# Altium schematic sheet AD8367_AGC.SchDoc
size A4
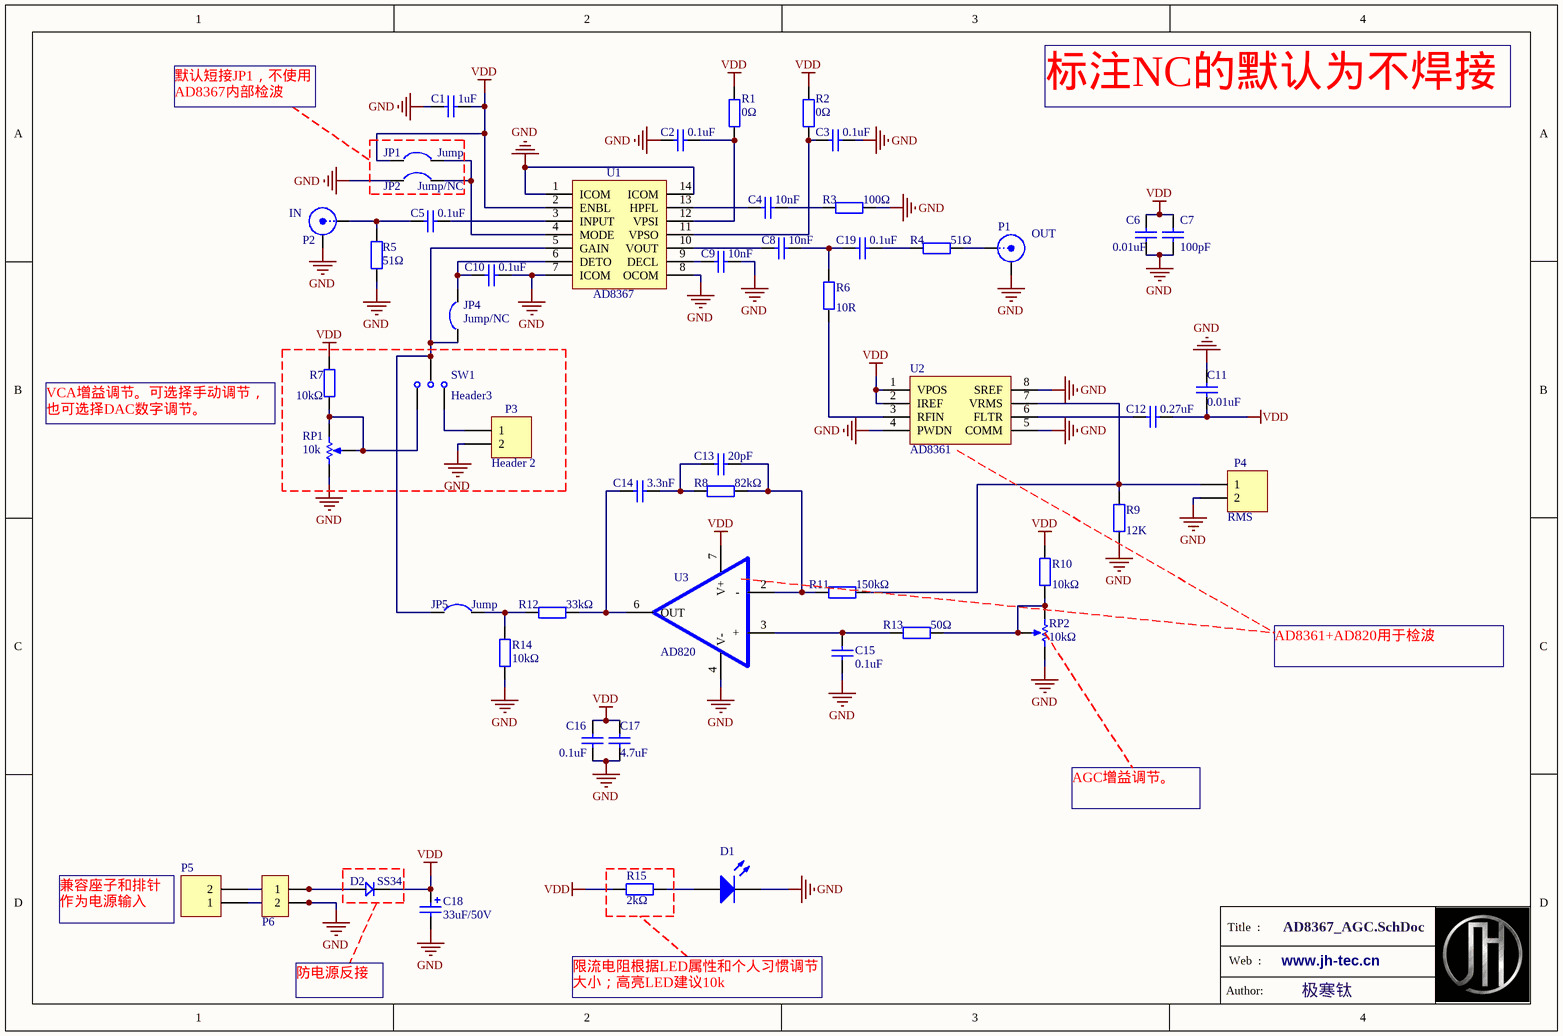
[diagram p0: AD8367_AGC.SchDoc]

## Parts
C1  1uF  [C0603]
C2  0.1uF  [C0603]
C3  0.1uF  [C0603]
C4  10nF  [C0603]
C5  0.1uF  [C0603]
C6  0.01uF  [C0603]
C7  100pF  [C0603]
C8  10nF  [C0603]
C9  10nF  [C0603]
C10  0.1uF  [C0603]
C11  0.01uF  [C0603]
C12  0.27uF  [C0603]
C13  20pF  [C0603]
C14  3.3nF  [C0603]
C15  0.1uF  [C0603]
C16  0.1uF  [C0603]
C17  4.7uF  [C0805]
C18  33uF/50V  [C6.3*7.7]
C19  0.1uF  [C0603]
D1  LED3  [LED_GREEN_0603]  (value not drawn)
D2  SS34  [DO-214AC]
JP1  Jump  [JUMP]
JP2  Jump/NC  [JUMP]
JP4  Jump/NC  [JUMP]
JP5  Jump  [JUMP]
P1  OUT  [SMA_3D]
P2  IN  [SMA_3D]
P3  Header 2  [HDR1X2]
P4  RMS  [HDR1X2]
P5  (no value)  [HDR1X2]
P6  HDR-1X2  [VH3.96-LI-2P]  (value not drawn)
R1  0Ω  [R0603]
R2  0Ω  [R0603]
R3  100Ω  [R0603]
R4  51Ω  [R0603]
R5  51Ω  [R0603]
R6  10R  [R0603]
R7  10kΩ  [R0603]
R8  82kΩ  [R0603]
R9  12K  [R0603]
R10  10kΩ  [R0603]
R11  150kΩ  [R0603]
R12  33kΩ  [R0603]
R13  50Ω  [R0603]
R14  10kΩ  [R0603]
R15  2kΩ  [R0603]
RP1  10k  [RP_3296W]
RP2  10kΩ  [RP_3296W]
SW1  Header3  [HDR1X3]
U1  AD8367  [TSSOP14]
U2  AD8361  [MSOP8]
U3  AD820  [SOP-8]

## Nets
GND: C1.1 C2.1 C3.1 C6.2 C7.2 C9.2 C10.2 C11.2 C15.2 C16.2 C17.1 C18.2 D1.2(K) JP2.1 P1.2(Y) P2.2(Y) P3.2 P4.2 P5.1 P6.2 R3.2 R5.2 R9.2 R14.2 RP1.1(TOP) RP2.3(BOT) U1.1(ICOM) U1.7(ICOM) U1.8(OCOM) U1.14(ICOM) U2.4(PWDN) U2.5(COMM) U2.8(SREF) U3.4(V-)
VDD: C1.2 C6.1 C7.1 C11.1 C12.2 C16.1 C17.2 C18.1 D2.2 JP1.1 R1.1 R2.1 R7.1 R10.1 R15.2 U1.2(ENBL) U2.1(VPOS) U2.2(IREF) U3.7(V+)
NetC2_2: C2.2 R1.2 U1.12(VPSI)
NetC3_2: C3.2 R2.2 U1.11(VPSO)
NetC4_1: C4.1 U1.13(HPFL)
NetC4_2: C4.2 R3.1
NetC5_1: C5.1 P2.1(X) R5.1
NetC5_2: C5.2 U1.3(INPUT)
NetC8_1: C8.1 U1.10(VOUT)
NetC8_2: C8.2 C19.1 R6.1
NetC9_1: C9.1 U1.9(DECL)
NetC10_1: C10.1 JP4.2 U1.6(DETO)
NetC12_1: C12.1 U2.6(FLTR)
NetC13_1: C13.1 C14.2 R8.1
NetC13_2: C13.2 R8.2 R11.1 U3.2(-)
NetC14_1: C14.1 R12.2 U3.6(OUT)
NetC15_1: C15.1 R13.1 U3.3(+)
NetC19_2: C19.2 R4.1
NetD1_1: D1.1(A) R15.1
NetD2_1: D2.1 P5.2 P6.1
NetJP1_2: JP1.2 JP2.2 U1.4(MODE)
NetJP4_1: JP4.1 JP5.1 SW1.2 U1.5(GAIN)
NetJP5_2: JP5.2 R12.1 R14.1
NetP1_1: P1.1(X) R4.2
NetP3_1: P3.1 SW1.1
NetP4_1: P4.1 R9.1 R11.2 U2.7(VRMS)
NetR6_2: R6.2 U2.3(RFIN)
NetR7_2: R7.2 RP1.2(TAP) RP1.3(BOT) SW1.3
NetR10_2: R10.2 R13.2 RP2.1(TOP) RP2.2(TAP)

## Notes on the sheet
- 默认短接JP1，不使用AD8367内部检波
- 标注NC的默认为不焊接
- VCA增益调节。可选择手动调节，也可选择DAC数字调节。
- AD8361+AD820用于检波
- AGC增益调节。
- (near P5) 兼容座子和排针作为电源输入
- 防电源反接
- 限流电阻根据LED属性和个人习惯调节大小；高亮LED建议10k
- Title  :
- Web  :
- www.jh-tec.cn
- Author:
- 极寒钛

## Library data of the parts
C1-C17 C19 = Cap Semi: Capacitor (Semiconductor SIM Model); Value: 103; Published: 8-Jun-2000; LatestRevisionDate: 29-May-2009; LatestRevisionNote: IPC-7351 Footprint Added.; PackageReference: C1206; Publisher: Altium Limited; PackageDescription: Chip Capacitor
C18 = Cap Pol3_1: Polarized Capacitor (Surface Mount); Value: 100uF; Published: 8-Jun-2000; LatestRevisionDate: 29-May-2009; LatestRevisionNote: IPC-7351 Footprint Added.; PackageReference: C0805; Publisher: Altium Limited; PackageDescription: Chip Capacitor
D1 = LED3: Typical BLUE SiC LED; Published: 8-Jun-2000; LatestRevisionDate: 17-Dec-2003; LatestRevisionNote: PCB Footprint replaced.; DatasheetVersion: 16-Apr-2002; PackageVersion: 16-Apr-2002; PackageReference: 3.5X2.8X1.9; Publisher: Altium Limited; PackageDescription: SM LED; 2 C-Bend Leads; Body 3.5 x 2.8 x 1.9 mm, inc leads (LxWxH typ)
D2 = D: 1N4148
JP2 JP4 = Jump
P1 P2 = SMA
P3-P5 = Header 2: Header, 2-Pin; LatestRevisionDate: 17-Jul-2002; LatestRevisionNote: Re-released for DXP Platform.; Publisher: Altium Limited
P6 = Header 2: 2P接插件; 版权归属: 源创客; BOM名称: 2P接插件; 学习资源: www.ooocke.com
R1-R15 = Res2: Resistor; Value: 1K; Published: 8-Jun-2000; LatestRevisionDate: 17-Jul-2002; LatestRevisionNote: Re-released for DXP Platform.; Publisher: Altium Limited
RP1 RP2 = SW_A
SW1 = SW
U3 = 单运放1